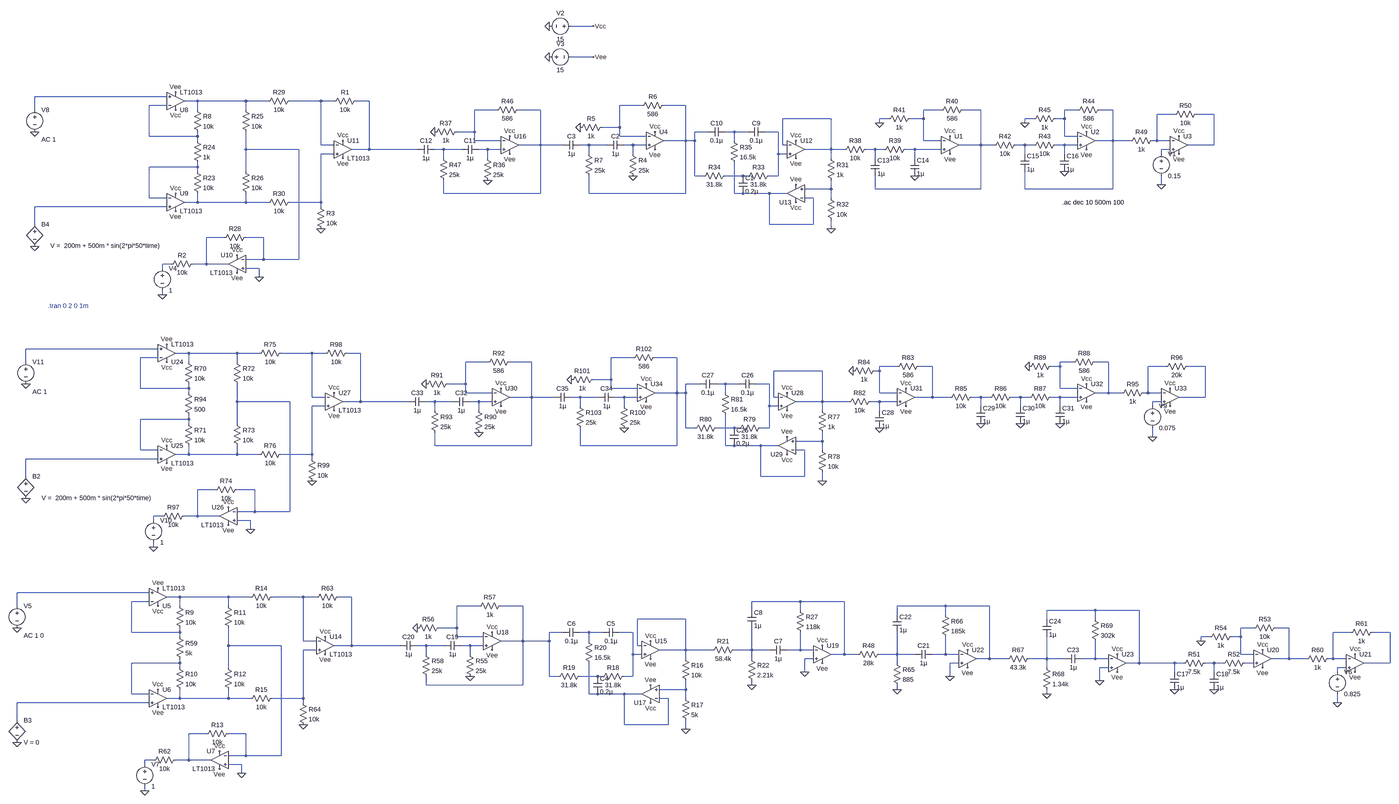
[diagram p0: schematic Final Schematic.asc, whole sheet]
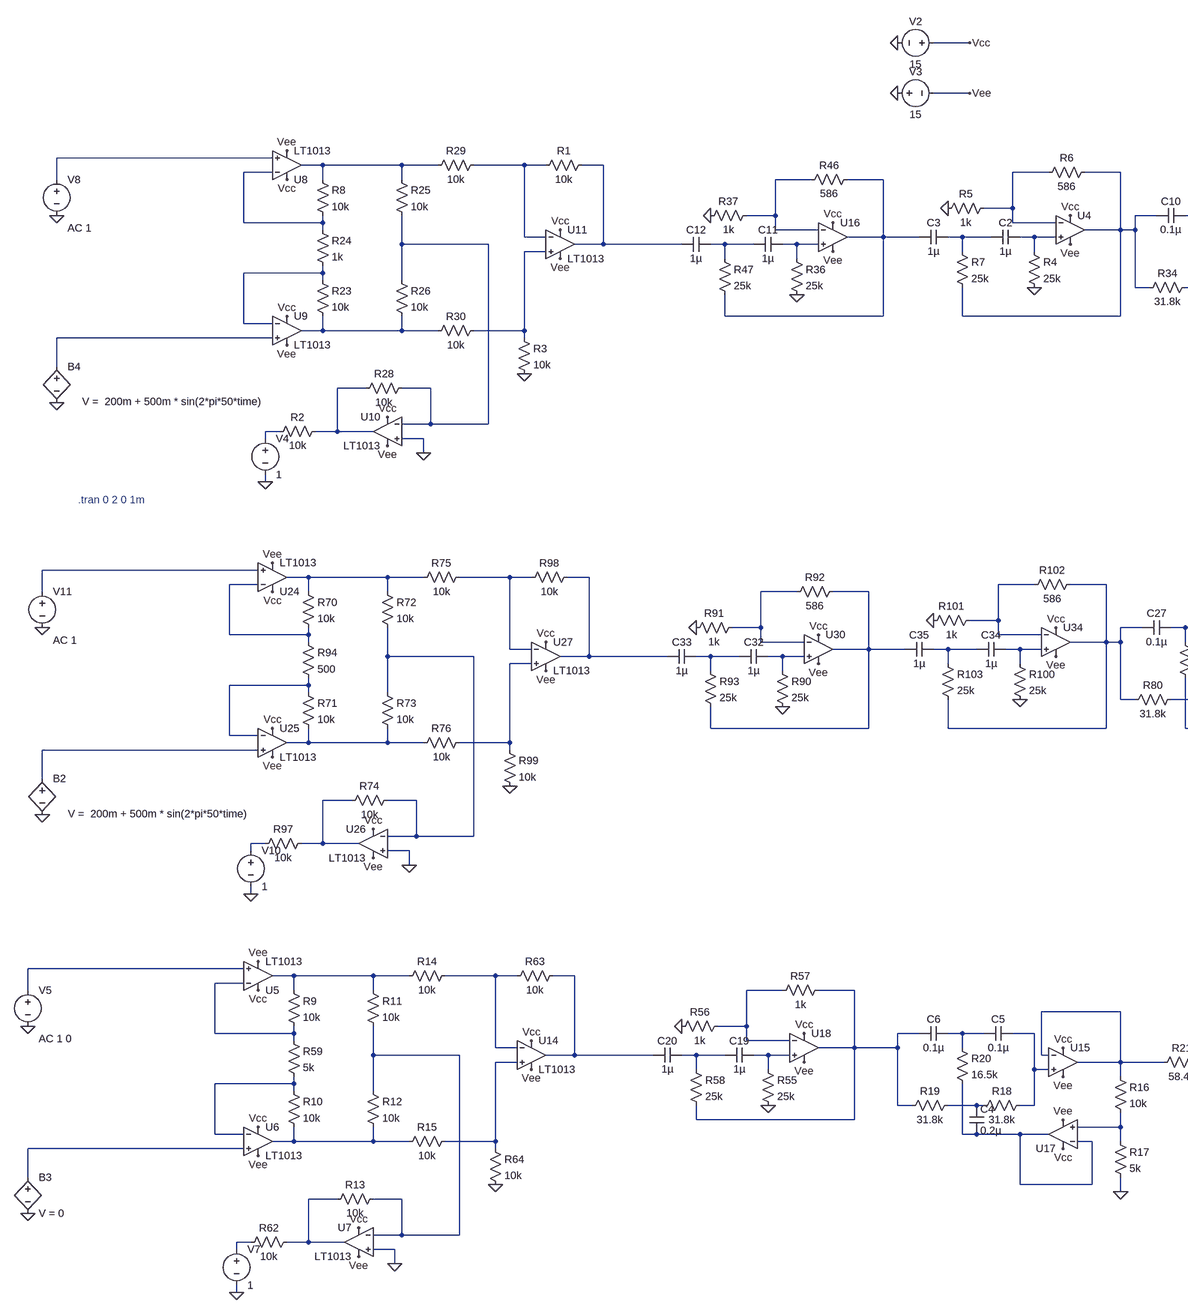
[diagram p1: schematic Final Schematic.asc, part, row 1 of 1, column 1 of 2]
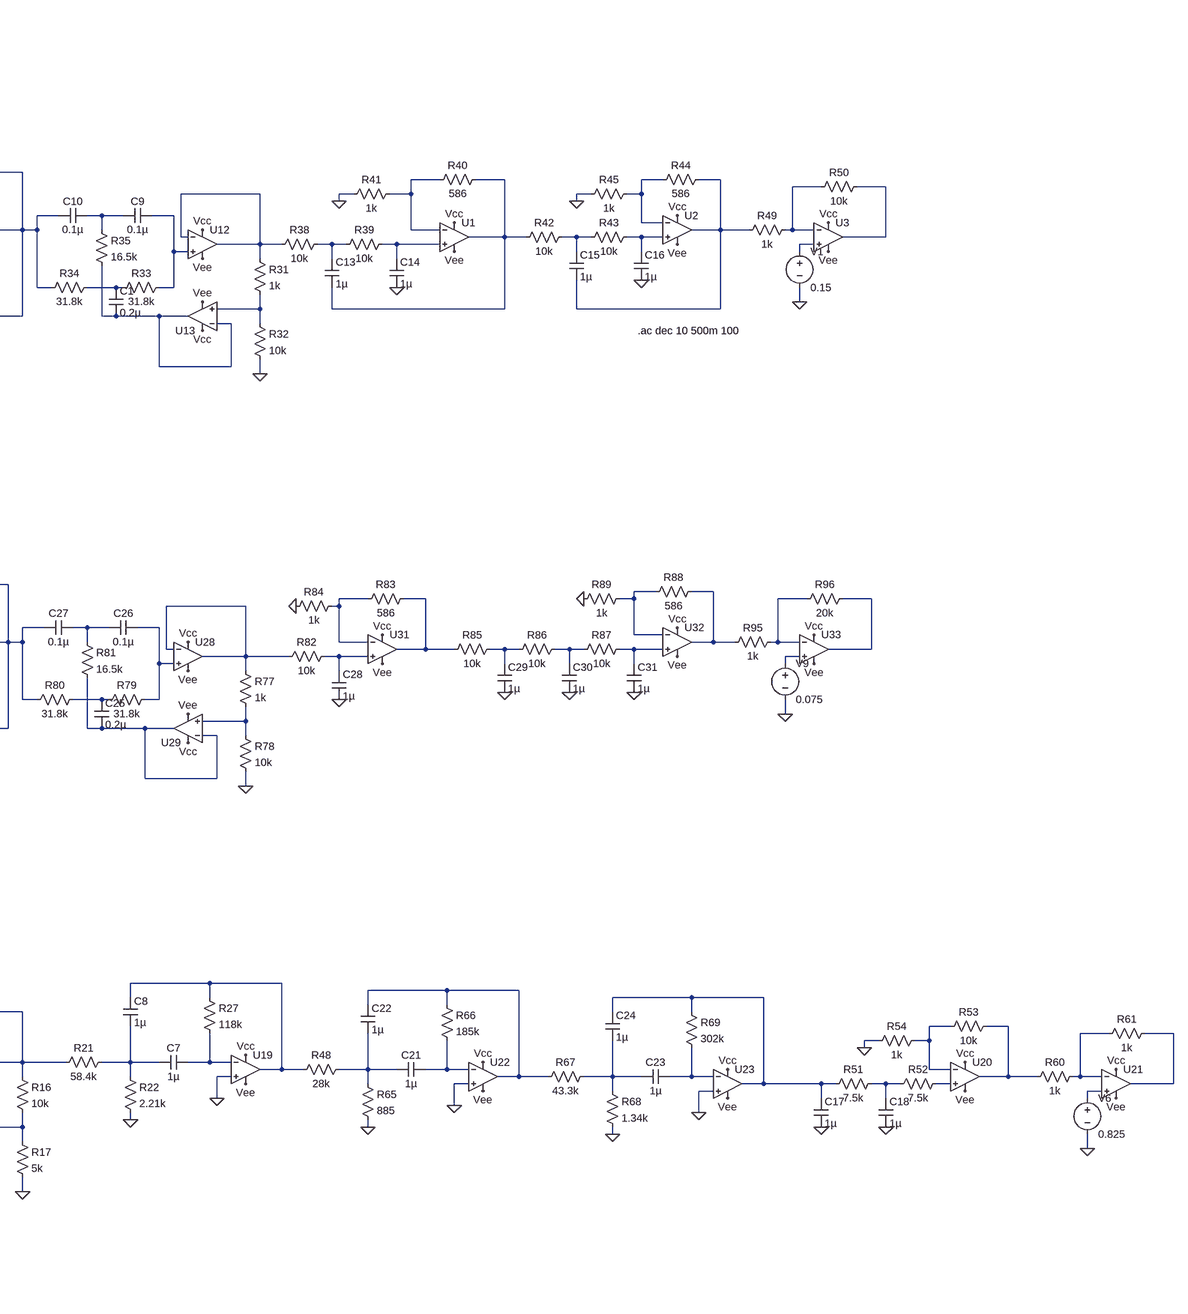
[diagram p2: schematic Final Schematic.asc, part, row 1 of 1, column 2 of 2]
Final Schematic.asc, the LTspice schematic file:
Version 4
SHEET 1 7924 5924
WIRE 2800 400 2720 400
WIRE 2800 512 2720 512
WIRE 1248 656 768 656
WIRE 1360 672 1312 672
WIRE 1536 672 1360 672
WIRE 1616 672 1536 672
WIRE 1808 672 1696 672
WIRE 1856 672 1808 672
WIRE 1984 672 1936 672
WIRE 1248 688 1184 688
WIRE 2976 688 2896 688
WIRE 3136 688 3056 688
WIRE 768 704 768 656
WIRE 1360 704 1360 672
WIRE 1536 704 1536 672
WIRE 2448 704 2368 704
WIRE 2608 704 2528 704
WIRE 4064 704 4000 704
WIRE 4208 704 4144 704
WIRE 4560 704 4512 704
WIRE 4688 704 4640 704
WIRE 4912 720 4848 720
WIRE 5056 720 4992 720
WIRE 3664 736 3488 736
WIRE 3872 736 3840 736
WIRE 4000 736 4000 704
WIRE 4000 736 3952 736
WIRE 4400 736 4368 736
WIRE 4512 736 4512 704
WIRE 4512 736 4480 736
WIRE 3840 752 3840 736
WIRE 4368 752 4368 736
WIRE 2896 768 2896 688
WIRE 2896 768 2832 768
WIRE 2368 784 2368 704
WIRE 2368 784 2304 784
WIRE 3216 784 3168 784
WIRE 3312 784 3280 784
WIRE 3360 784 3312 784
WIRE 3472 784 3424 784
WIRE 1184 800 1184 688
WIRE 1360 800 1360 784
WIRE 1360 800 1184 800
WIRE 2896 800 2896 768
WIRE 2992 800 2896 800
WIRE 4512 800 4512 736
WIRE 4560 800 4512 800
WIRE 1360 816 1360 800
WIRE 2368 816 2368 784
WIRE 2464 816 2368 816
WIRE 3136 816 3136 688
WIRE 3136 816 3056 816
WIRE 3168 816 3168 784
WIRE 3168 816 3136 816
WIRE 3312 816 3312 784
WIRE 4000 816 4000 736
WIRE 4064 816 4000 816
WIRE 4688 816 4688 704
WIRE 4688 816 4624 816
WIRE 4752 816 4688 816
WIRE 4848 816 4848 720
WIRE 4848 816 4832 816
WIRE 4896 816 4848 816
WIRE 1808 832 1808 672
WIRE 1856 832 1808 832
WIRE 2608 832 2608 704
WIRE 2608 832 2528 832
WIRE 2688 832 2608 832
WIRE 2784 832 2752 832
WIRE 2848 832 2784 832
WIRE 2944 832 2912 832
WIRE 2992 832 2944 832
WIRE 3488 832 3488 736
WIRE 3504 832 3488 832
WIRE 4208 832 4208 704
WIRE 4208 832 4128 832
WIRE 4256 832 4208 832
WIRE 4368 832 4336 832
WIRE 4400 832 4368 832
WIRE 4512 832 4480 832
WIRE 4560 832 4512 832
WIRE 5056 832 5056 720
WIRE 5056 832 4960 832
WIRE 1536 848 1536 784
WIRE 1728 848 1536 848
WIRE 1984 848 1984 672
WIRE 1984 848 1920 848
WIRE 2160 848 1984 848
WIRE 2256 848 2224 848
WIRE 2320 848 2256 848
WIRE 2416 848 2384 848
WIRE 2464 848 2416 848
WIRE 3664 848 3664 736
WIRE 3664 848 3568 848
WIRE 3712 848 3664 848
WIRE 3824 848 3792 848
WIRE 3856 848 3824 848
WIRE 3968 848 3936 848
WIRE 4064 848 3968 848
WIRE 4896 848 4864 848
WIRE 1856 864 1808 864
WIRE 2784 864 2784 832
WIRE 2944 864 2944 832
WIRE 3472 864 3472 784
WIRE 3504 864 3472 864
WIRE 4368 864 4368 832
WIRE 4512 864 4512 832
WIRE 4864 864 4864 848
WIRE 2256 880 2256 848
WIRE 2416 880 2416 848
WIRE 3664 880 3664 848
WIRE 3824 880 3824 848
WIRE 3968 880 3968 848
WIRE 1360 912 1360 896
WIRE 1360 912 1184 912
WIRE 1360 928 1360 912
WIRE 1536 928 1536 848
WIRE 3168 944 3168 816
WIRE 3200 944 3168 944
WIRE 3344 944 3280 944
WIRE 3360 944 3344 944
WIRE 3472 944 3472 864
WIRE 3472 944 3440 944
WIRE 4864 976 4864 944
WIRE 3664 992 3664 960
WIRE 3664 992 3568 992
WIRE 3824 992 3824 944
WIRE 4208 992 4208 832
WIRE 4208 992 3824 992
WIRE 4368 992 4368 928
WIRE 4688 992 4688 816
WIRE 4688 992 4368 992
WIRE 2256 1008 2256 960
WIRE 2608 1008 2608 832
WIRE 2608 1008 2256 1008
WIRE 2784 1008 2784 944
WIRE 3136 1008 3136 816
WIRE 3136 1008 2784 1008
WIRE 3312 1008 3312 896
WIRE 3344 1008 3312 1008
WIRE 3440 1008 3344 1008
WIRE 3504 1008 3440 1008
WIRE 1184 1024 1184 912
WIRE 1248 1024 1184 1024
WIRE 3600 1024 3568 1024
WIRE 3664 1024 3664 992
WIRE 1360 1040 1360 1008
WIRE 1360 1040 1312 1040
WIRE 1536 1040 1536 1008
WIRE 1536 1040 1360 1040
WIRE 1616 1040 1536 1040
WIRE 1808 1040 1808 864
WIRE 1808 1040 1696 1040
WIRE 1248 1056 768 1056
WIRE 1808 1056 1808 1040
WIRE 768 1120 768 1056
WIRE 3440 1120 3440 1008
WIRE 3600 1120 3600 1024
WIRE 3600 1120 3440 1120
WIRE 3664 1136 3664 1104
WIRE 1456 1168 1392 1168
WIRE 1600 1168 1536 1168
WIRE 1600 1248 1600 1168
WIRE 1600 1248 1536 1248
WIRE 1728 1248 1728 848
WIRE 1728 1248 1600 1248
WIRE 1264 1264 1232 1264
WIRE 1392 1264 1392 1168
WIRE 1392 1264 1344 1264
WIRE 1472 1264 1392 1264
WIRE 1232 1280 1232 1264
WIRE 1584 1280 1536 1280
WIRE 1584 1312 1584 1280
WIRE 1232 1376 1232 1360
WIRE 1216 1664 736 1664
WIRE 1328 1680 1280 1680
WIRE 1504 1680 1328 1680
WIRE 1584 1680 1504 1680
WIRE 1776 1680 1664 1680
WIRE 1824 1680 1776 1680
WIRE 1952 1680 1904 1680
WIRE 1216 1696 1152 1696
WIRE 2944 1696 2864 1696
WIRE 3104 1696 3024 1696
WIRE 736 1712 736 1664
WIRE 1328 1712 1328 1680
WIRE 1504 1712 1504 1680
WIRE 2416 1712 2336 1712
WIRE 2576 1712 2496 1712
WIRE 4544 1712 4496 1712
WIRE 4672 1712 4624 1712
WIRE 3904 1728 3840 1728
WIRE 4032 1728 3984 1728
WIRE 4496 1728 4496 1712
WIRE 4496 1728 4464 1728
WIRE 4880 1728 4816 1728
WIRE 5024 1728 4960 1728
WIRE 3632 1744 3456 1744
WIRE 3840 1744 3840 1728
WIRE 3840 1744 3824 1744
WIRE 2864 1776 2864 1696
WIRE 2864 1776 2800 1776
WIRE 2336 1792 2336 1712
WIRE 2336 1792 2272 1792
WIRE 3184 1792 3136 1792
WIRE 3280 1792 3248 1792
WIRE 3328 1792 3280 1792
WIRE 3440 1792 3392 1792
WIRE 1152 1808 1152 1696
WIRE 1328 1808 1328 1792
WIRE 1328 1808 1152 1808
WIRE 2864 1808 2864 1776
WIRE 2960 1808 2864 1808
WIRE 4496 1808 4496 1728
WIRE 4560 1808 4496 1808
WIRE 1328 1824 1328 1808
WIRE 2336 1824 2336 1792
WIRE 2432 1824 2336 1824
WIRE 3104 1824 3104 1696
WIRE 3104 1824 3024 1824
WIRE 3136 1824 3136 1792
WIRE 3136 1824 3104 1824
WIRE 3280 1824 3280 1792
WIRE 3840 1824 3840 1744
WIRE 3904 1824 3840 1824
WIRE 4672 1824 4672 1712
WIRE 4672 1824 4624 1824
WIRE 4720 1824 4672 1824
WIRE 4816 1824 4816 1728
WIRE 4816 1824 4800 1824
WIRE 4864 1824 4816 1824
WIRE 1776 1840 1776 1680
WIRE 1824 1840 1776 1840
WIRE 2576 1840 2576 1712
WIRE 2576 1840 2496 1840
WIRE 2656 1840 2576 1840
WIRE 2752 1840 2720 1840
WIRE 2816 1840 2752 1840
WIRE 2912 1840 2880 1840
WIRE 2960 1840 2912 1840
WIRE 3456 1840 3456 1744
WIRE 3472 1840 3456 1840
WIRE 4032 1840 4032 1728
WIRE 4032 1840 3968 1840
WIRE 4096 1840 4032 1840
WIRE 4208 1840 4176 1840
WIRE 4240 1840 4208 1840
WIRE 4352 1840 4320 1840
WIRE 4384 1840 4352 1840
WIRE 4496 1840 4464 1840
WIRE 4560 1840 4496 1840
WIRE 5024 1840 5024 1728
WIRE 5024 1840 4928 1840
WIRE 1504 1856 1504 1792
WIRE 1696 1856 1504 1856
WIRE 1952 1856 1952 1680
WIRE 1952 1856 1888 1856
WIRE 2128 1856 1952 1856
WIRE 2224 1856 2192 1856
WIRE 2288 1856 2224 1856
WIRE 2384 1856 2352 1856
WIRE 2432 1856 2384 1856
WIRE 3632 1856 3632 1744
WIRE 3632 1856 3536 1856
WIRE 3728 1856 3632 1856
WIRE 3840 1856 3808 1856
WIRE 3904 1856 3840 1856
WIRE 4864 1856 4832 1856
WIRE 1824 1872 1776 1872
WIRE 2752 1872 2752 1840
WIRE 2912 1872 2912 1840
WIRE 3440 1872 3440 1792
WIRE 3472 1872 3440 1872
WIRE 4208 1872 4208 1840
WIRE 4352 1872 4352 1840
WIRE 4496 1872 4496 1840
WIRE 4832 1872 4832 1856
WIRE 2224 1888 2224 1856
WIRE 2384 1888 2384 1856
WIRE 3632 1888 3632 1856
WIRE 3840 1888 3840 1856
WIRE 1328 1920 1328 1904
WIRE 1328 1920 1152 1920
WIRE 1328 1936 1328 1920
WIRE 1504 1936 1504 1856
WIRE 3136 1952 3136 1824
WIRE 3168 1952 3136 1952
WIRE 3312 1952 3248 1952
WIRE 3328 1952 3312 1952
WIRE 3440 1952 3440 1872
WIRE 3440 1952 3408 1952
WIRE 4832 1984 4832 1952
WIRE 3632 2000 3632 1968
WIRE 3632 2000 3536 2000
WIRE 2224 2016 2224 1968
WIRE 2576 2016 2576 1840
WIRE 2576 2016 2224 2016
WIRE 2752 2016 2752 1952
WIRE 3104 2016 3104 1824
WIRE 3104 2016 2752 2016
WIRE 3280 2016 3280 1904
WIRE 3312 2016 3280 2016
WIRE 3408 2016 3312 2016
WIRE 3472 2016 3408 2016
WIRE 1152 2032 1152 1920
WIRE 1216 2032 1152 2032
WIRE 3568 2032 3536 2032
WIRE 3632 2032 3632 2000
WIRE 1328 2048 1328 2016
WIRE 1328 2048 1280 2048
WIRE 1504 2048 1504 2016
WIRE 1504 2048 1328 2048
WIRE 1584 2048 1504 2048
WIRE 1776 2048 1776 1872
WIRE 1776 2048 1664 2048
WIRE 1216 2064 736 2064
WIRE 1776 2064 1776 2048
WIRE 736 2128 736 2064
WIRE 3408 2128 3408 2016
WIRE 3568 2128 3568 2032
WIRE 3568 2128 3408 2128
WIRE 3632 2144 3632 2112
WIRE 1424 2176 1360 2176
WIRE 1568 2176 1504 2176
WIRE 1568 2256 1568 2176
WIRE 1568 2256 1504 2256
WIRE 1696 2256 1696 1856
WIRE 1696 2256 1568 2256
WIRE 1232 2272 1200 2272
WIRE 1360 2272 1360 2176
WIRE 1360 2272 1312 2272
WIRE 1440 2272 1360 2272
WIRE 1200 2288 1200 2272
WIRE 1552 2288 1504 2288
WIRE 1552 2320 1552 2288
WIRE 1200 2384 1200 2368
WIRE 1184 2672 704 2672
WIRE 1296 2688 1248 2688
WIRE 1472 2688 1296 2688
WIRE 1552 2688 1472 2688
WIRE 1744 2688 1632 2688
WIRE 1792 2688 1744 2688
WIRE 1920 2688 1872 2688
WIRE 1184 2704 1120 2704
WIRE 3552 2704 3376 2704
WIRE 3712 2704 3552 2704
WIRE 704 2720 704 2672
WIRE 1296 2720 1296 2688
WIRE 1472 2720 1472 2688
WIRE 2384 2720 2304 2720
WIRE 2544 2720 2464 2720
WIRE 4080 2720 3904 2720
WIRE 4240 2720 4080 2720
WIRE 3376 2736 3376 2704
WIRE 3552 2736 3552 2704
WIRE 4624 2736 4448 2736
WIRE 4784 2736 4624 2736
WIRE 3904 2752 3904 2720
WIRE 4080 2752 4080 2720
WIRE 3136 2768 2960 2768
WIRE 4448 2768 4448 2736
WIRE 4624 2768 4624 2736
WIRE 2304 2800 2304 2720
WIRE 2304 2800 2240 2800
WIRE 5200 2800 5152 2800
WIRE 5328 2800 5280 2800
WIRE 1120 2816 1120 2704
WIRE 1296 2816 1296 2800
WIRE 1296 2816 1120 2816
WIRE 2688 2816 2640 2816
WIRE 2784 2816 2752 2816
WIRE 2832 2816 2784 2816
WIRE 2944 2816 2896 2816
WIRE 5552 2816 5488 2816
WIRE 5696 2816 5632 2816
WIRE 1296 2832 1296 2816
WIRE 2304 2832 2304 2800
WIRE 2400 2832 2304 2832
WIRE 5040 2832 5008 2832
WIRE 5152 2832 5152 2800
WIRE 5152 2832 5120 2832
WIRE 1744 2848 1744 2688
WIRE 1792 2848 1744 2848
WIRE 2544 2848 2544 2720
WIRE 2544 2848 2464 2848
WIRE 2640 2848 2640 2816
WIRE 2640 2848 2544 2848
WIRE 2784 2848 2784 2816
WIRE 5008 2848 5008 2832
WIRE 1472 2864 1472 2800
WIRE 1664 2864 1472 2864
WIRE 1920 2864 1920 2688
WIRE 1920 2864 1856 2864
WIRE 2096 2864 1920 2864
WIRE 2192 2864 2160 2864
WIRE 2256 2864 2192 2864
WIRE 2352 2864 2320 2864
WIRE 2400 2864 2352 2864
WIRE 2960 2864 2960 2768
WIRE 2976 2864 2960 2864
WIRE 1792 2880 1744 2880
WIRE 3136 2880 3136 2768
WIRE 3136 2880 3040 2880
WIRE 3232 2880 3136 2880
WIRE 3376 2880 3376 2800
WIRE 3376 2880 3312 2880
WIRE 3440 2880 3376 2880
WIRE 3552 2880 3552 2816
WIRE 3552 2880 3504 2880
WIRE 3600 2880 3552 2880
WIRE 2192 2896 2192 2864
WIRE 2352 2896 2352 2864
WIRE 2944 2896 2944 2816
WIRE 2976 2896 2944 2896
WIRE 3712 2896 3712 2704
WIRE 3712 2896 3664 2896
WIRE 3760 2896 3712 2896
WIRE 3904 2896 3904 2816
WIRE 3904 2896 3840 2896
WIRE 3968 2896 3904 2896
WIRE 4080 2896 4080 2832
WIRE 4080 2896 4032 2896
WIRE 4128 2896 4080 2896
WIRE 5152 2896 5152 2832
WIRE 5200 2896 5152 2896
WIRE 3136 2912 3136 2880
WIRE 3376 2912 3376 2880
WIRE 3600 2912 3568 2912
WIRE 4240 2912 4240 2720
WIRE 4240 2912 4192 2912
WIRE 4304 2912 4240 2912
WIRE 4448 2912 4448 2832
WIRE 4448 2912 4384 2912
WIRE 4512 2912 4448 2912
WIRE 4624 2912 4624 2848
WIRE 4624 2912 4576 2912
WIRE 4672 2912 4624 2912
WIRE 5328 2912 5328 2800
WIRE 5328 2912 5264 2912
WIRE 5392 2912 5328 2912
WIRE 5488 2912 5488 2816
WIRE 5488 2912 5472 2912
WIRE 5536 2912 5488 2912
WIRE 1296 2928 1296 2912
WIRE 1296 2928 1120 2928
WIRE 3904 2928 3904 2896
WIRE 4128 2928 4096 2928
WIRE 4784 2928 4784 2736
WIRE 4784 2928 4736 2928
WIRE 4912 2928 4784 2928
WIRE 4944 2928 4912 2928
WIRE 5056 2928 5024 2928
WIRE 5088 2928 5056 2928
WIRE 5200 2928 5168 2928
WIRE 5696 2928 5696 2816
WIRE 5696 2928 5600 2928
WIRE 1296 2944 1296 2928
WIRE 1472 2944 1472 2864
WIRE 4448 2944 4448 2912
WIRE 4672 2944 4640 2944
WIRE 5536 2944 5504 2944
WIRE 3568 2960 3568 2912
WIRE 4912 2960 4912 2928
WIRE 5056 2960 5056 2928
WIRE 5504 2960 5504 2944
WIRE 2640 2976 2640 2848
WIRE 2672 2976 2640 2976
WIRE 2816 2976 2752 2976
WIRE 2832 2976 2816 2976
WIRE 2944 2976 2944 2896
WIRE 2944 2976 2912 2976
WIRE 4096 2976 4096 2928
WIRE 4640 2992 4640 2944
WIRE 2192 3008 2192 2976
WIRE 2544 3008 2544 2848
WIRE 2544 3008 2192 3008
WIRE 3376 3008 3376 2992
WIRE 3136 3024 3136 2992
WIRE 3136 3024 3040 3024
WIRE 3904 3024 3904 3008
WIRE 1120 3040 1120 2928
WIRE 1184 3040 1120 3040
WIRE 2784 3040 2784 2928
WIRE 2816 3040 2784 3040
WIRE 2912 3040 2816 3040
WIRE 2976 3040 2912 3040
WIRE 4448 3040 4448 3024
WIRE 1296 3056 1296 3024
WIRE 1296 3056 1248 3056
WIRE 1472 3056 1472 3024
WIRE 1472 3056 1296 3056
WIRE 1552 3056 1472 3056
WIRE 1744 3056 1744 2880
WIRE 1744 3056 1632 3056
WIRE 3072 3056 3040 3056
WIRE 3136 3056 3136 3024
WIRE 1184 3072 704 3072
WIRE 1744 3072 1744 3056
WIRE 5504 3072 5504 3040
WIRE 704 3136 704 3072
WIRE 2912 3152 2912 3040
WIRE 3072 3152 3072 3056
WIRE 3072 3152 2912 3152
WIRE 3136 3168 3136 3136
WIRE 1392 3184 1328 3184
WIRE 1536 3184 1472 3184
WIRE 1536 3264 1536 3184
WIRE 1536 3264 1472 3264
WIRE 1664 3264 1664 2864
WIRE 1664 3264 1536 3264
WIRE 1200 3280 1168 3280
WIRE 1328 3280 1328 3184
WIRE 1328 3280 1280 3280
WIRE 1408 3280 1328 3280
WIRE 1168 3296 1168 3280
WIRE 1520 3296 1472 3296
WIRE 1520 3328 1520 3296
WIRE 1168 3392 1168 3376
FLAG 2640 512 0
FLAG 2640 400 0
FLAG 2800 400 Vcc
FLAG 2800 512 Vee
FLAG 1584 1312 0
FLAG 1280 704 Vcc
FLAG 1280 1008 Vcc
FLAG 1280 640 Vee
FLAG 1280 1072 Vee
FLAG 1888 816 Vcc
FLAG 1888 880 Vee
FLAG 1504 1296 Vee
FLAG 1504 1232 Vcc
FLAG 768 1200 0
FLAG 768 784 0
FLAG 3664 1136 0
FLAG 3536 816 Vcc
FLAG 3536 1040 Vcc
FLAG 3536 880 Vee
FLAG 3536 976 Vee
FLAG 3840 752 0
FLAG 4368 752 0
FLAG 4096 800 Vcc
FLAG 4096 864 Vee
FLAG 4592 784 Vcc
FLAG 4592 848 Vee
FLAG 2416 960 0
FLAG 2496 800 Vcc
FLAG 2496 864 Vee
FLAG 4864 976 0
FLAG 4928 800 Vcc
FLAG 4928 864 Vee
FLAG 1232 1376 0
FLAG 1808 1136 0
FLAG 2944 944 0
FLAG 3024 784 Vcc
FLAG 3024 848 Vee
FLAG 2224 784 0
FLAG 2752 768 0
FLAG 1520 3328 0
FLAG 1216 2720 Vcc
FLAG 1216 3024 Vcc
FLAG 1216 2656 Vee
FLAG 1216 3088 Vee
FLAG 1824 2832 Vcc
FLAG 1824 2896 Vee
FLAG 1440 3312 Vee
FLAG 1440 3248 Vcc
FLAG 704 3216 0
FLAG 704 2800 0
FLAG 3136 3168 0
FLAG 3008 2848 Vcc
FLAG 3008 3072 Vcc
FLAG 3008 2912 Vee
FLAG 3008 3008 Vee
FLAG 5056 3024 0
FLAG 4912 3024 0
FLAG 5008 2848 0
FLAG 5232 2880 Vcc
FLAG 5232 2944 Vee
FLAG 2352 2976 0
FLAG 2432 2816 Vcc
FLAG 2432 2880 Vee
FLAG 5504 3072 0
FLAG 5568 2896 Vcc
FLAG 5568 2960 Vee
FLAG 1168 3392 0
FLAG 1744 3152 0
FLAG 2160 2800 0
FLAG 3376 3008 0
FLAG 3568 2960 0
FLAG 3632 2864 Vcc
FLAG 3632 2928 Vee
FLAG 3904 3024 0
FLAG 4096 2976 0
FLAG 4160 2880 Vcc
FLAG 4160 2944 Vee
FLAG 4448 3040 0
FLAG 4640 2992 0
FLAG 4704 2896 Vcc
FLAG 4704 2960 Vee
FLAG 1552 2320 0
FLAG 1248 1712 Vcc
FLAG 1248 2016 Vcc
FLAG 1248 1648 Vee
FLAG 1248 2080 Vee
FLAG 1856 1824 Vcc
FLAG 1856 1888 Vee
FLAG 1472 2304 Vee
FLAG 1472 2240 Vcc
FLAG 736 2208 0
FLAG 736 1792 0
FLAG 3632 2144 0
FLAG 3504 1824 Vcc
FLAG 3504 2048 Vcc
FLAG 3504 1888 Vee
FLAG 3504 1984 Vee
FLAG 2384 1968 0
FLAG 2464 1808 Vcc
FLAG 2464 1872 Vee
FLAG 4832 1984 0
FLAG 4896 1808 Vcc
FLAG 4896 1872 Vee
FLAG 1200 2384 0
FLAG 1776 2144 0
FLAG 2912 1952 0
FLAG 2992 1792 Vcc
FLAG 2992 1856 Vee
FLAG 2192 1792 0
FLAG 2720 1776 0
FLAG 3840 1952 0
FLAG 3936 1808 Vcc
FLAG 3936 1872 Vee
FLAG 3744 1744 0
FLAG 4592 1792 Vcc
FLAG 4592 1856 Vee
FLAG 4384 1728 0
FLAG 4496 1936 0
FLAG 4352 1936 0
FLAG 4208 1936 0
FLAG 3968 944 0
FLAG 4512 928 0
SYMBOL voltage 2736 400 R90
WINDOW 0 -32 56 VBottom 2
WINDOW 3 32 56 VTop 2
SYMATTR InstName V2
SYMATTR Value 15
SYMBOL voltage 2624 512 R270
WINDOW 0 32 56 VTop 2
WINDOW 3 -32 56 VBottom 2
SYMATTR InstName V3
SYMATTR Value 15
SYMBOL bv 768 1104 R0
WINDOW 3 57 94 Left 2
SYMATTR Value V =  200m + 500m * sin(2*pi*50*time)
SYMATTR InstName B4
SYMBOL OpAmps\\LT1013 1280 736 M180
SYMATTR InstName U8
SYMBOL OpAmps\\LT1013 1280 976 R0
SYMATTR InstName U9
SYMBOL res 1344 688 R0
SYMATTR InstName R8
SYMATTR Value 10k
SYMBOL res 1344 912 R0
SYMATTR InstName R23
SYMATTR Value 10k
SYMBOL res 1520 688 R0
SYMATTR InstName R25
SYMATTR Value 10k
SYMBOL res 1520 912 R0
SYMATTR InstName R26
SYMATTR Value 10k
SYMBOL OpAmps\\LT1013 1504 1200 M0
SYMATTR InstName U10
SYMBOL OpAmps\\LT1013 1888 784 R0
SYMATTR InstName U11
SYMBOL res 1552 1152 R90
WINDOW 0 0 56 VBottom 2
WINDOW 3 32 56 VTop 2
SYMATTR InstName R28
SYMATTR Value 10k
SYMBOL res 1712 656 R90
WINDOW 0 0 56 VBottom 2
WINDOW 3 32 56 VTop 2
SYMATTR InstName R29
SYMATTR Value 10k
SYMBOL res 1712 1024 R90
WINDOW 0 0 56 VBottom 2
WINDOW 3 32 56 VTop 2
SYMATTR InstName R30
SYMATTR Value 10k
SYMBOL OpAmps\\UniversalOpAmp2 3536 848 R0
SYMATTR InstName U12
SYMBOL OpAmps\\UniversalOpAmp2 3536 1008 R180
SYMATTR InstName U13
SYMBOL res 3648 864 R0
SYMATTR InstName R31
SYMATTR Value 1k
SYMBOL res 3648 1008 R0
SYMATTR InstName R32
SYMATTR Value 10k
SYMBOL res 3456 928 R90
WINDOW 0 0 56 VBottom 2
WINDOW 3 32 56 VTop 2
SYMATTR InstName R33
SYMATTR Value 31.8k
SYMBOL cap 3328 944 R0
SYMATTR InstName C1
SYMATTR Value 0.2µ
SYMBOL res 3296 928 R90
WINDOW 0 0 56 VBottom 2
WINDOW 3 32 56 VTop 2
SYMATTR InstName R34
SYMATTR Value 31.8k
SYMBOL res 3296 800 R0
SYMATTR InstName R35
SYMATTR Value 16.5k
SYMBOL cap 3424 768 R90
WINDOW 0 0 32 VBottom 2
WINDOW 3 32 32 VTop 2
SYMATTR InstName C9
SYMATTR Value 0.1µ
SYMBOL cap 3280 768 R90
WINDOW 0 0 32 VBottom 2
WINDOW 3 32 32 VTop 2
SYMATTR InstName C10
SYMATTR Value 0.1µ
SYMBOL res 4160 688 R90
WINDOW 0 0 56 VBottom 2
WINDOW 3 32 56 VTop 2
SYMATTR InstName R40
SYMATTR Value 586
SYMBOL res 3968 720 R90
WINDOW 0 0 56 VBottom 2
WINDOW 3 32 56 VTop 2
SYMATTR InstName R41
SYMATTR Value 1k
SYMBOL res 4656 688 R90
WINDOW 0 0 56 VBottom 2
WINDOW 3 32 56 VTop 2
SYMATTR InstName R44
SYMATTR Value 586
SYMBOL res 4496 720 R90
WINDOW 0 0 56 VBottom 2
WINDOW 3 32 56 VTop 2
SYMATTR InstName R45
SYMATTR Value 1k
SYMBOL OpAmps\\UniversalOpAmp2 2496 832 R0
SYMATTR InstName U16
SYMBOL cap 2384 832 R90
WINDOW 0 0 32 VBottom 2
WINDOW 3 32 32 VTop 2
SYMATTR InstName C11
SYMATTR Value 1µ
SYMBOL res 2400 864 R0
SYMATTR InstName R36
SYMATTR Value 25k
SYMBOL res 2320 768 R90
WINDOW 0 0 56 VBottom 2
WINDOW 3 32 56 VTop 2
SYMATTR InstName R37
SYMATTR Value 1k
SYMBOL res 2544 688 R90
WINDOW 0 0 56 VBottom 2
WINDOW 3 32 56 VTop 2
SYMATTR InstName R46
SYMATTR Value 586
SYMBOL res 2240 864 R0
SYMATTR InstName R47
SYMATTR Value 25k
SYMBOL cap 2224 832 R90
WINDOW 0 0 32 VBottom 2
WINDOW 3 32 32 VTop 2
SYMATTR InstName C12
SYMATTR Value 1µ
SYMBOL res 1344 800 R0
SYMATTR InstName R24
SYMATTR Value 1k
SYMBOL res 4848 800 R90
WINDOW 0 0 56 VBottom 2
WINDOW 3 32 56 VTop 2
SYMATTR InstName R49
SYMATTR Value 1k
SYMBOL res 5008 704 R90
WINDOW 0 0 56 VBottom 2
WINDOW 3 32 56 VTop 2
SYMATTR InstName R50
SYMATTR Value 10k
SYMBOL OpAmps\\UniversalOpAmp2 4096 832 R0
SYMATTR InstName U1
SYMBOL OpAmps\\UniversalOpAmp2 4592 816 R0
SYMATTR InstName U2
SYMBOL OpAmps\\UniversalOpAmp2 4928 832 R0
SYMATTR InstName U3
SYMBOL res 1360 1248 R90
WINDOW 0 0 56 VBottom 2
WINDOW 3 32 56 VTop 2
SYMATTR InstName R2
SYMATTR Value 10k
SYMBOL voltage 4864 848 R0
SYMATTR InstName V1
SYMATTR Value 0.15
SYMBOL res 1952 656 R90
WINDOW 0 0 56 VBottom 2
WINDOW 3 32 56 VTop 2
SYMATTR InstName R1
SYMATTR Value 10k
SYMBOL voltage 1232 1264 R0
WINDOW 123 0 0 Left 0
WINDOW 39 0 0 Left 0
SYMATTR InstName V4
SYMATTR Value 1
SYMBOL res 1792 1040 R0
SYMATTR InstName R3
SYMATTR Value 10k
SYMBOL OpAmps\\UniversalOpAmp2 3024 816 R0
SYMATTR InstName U4
SYMBOL cap 2912 816 R90
WINDOW 0 0 32 VBottom 2
WINDOW 3 32 32 VTop 2
SYMATTR InstName C2
SYMATTR Value 1µ
SYMBOL res 2928 848 R0
SYMATTR InstName R4
SYMATTR Value 25k
SYMBOL res 2848 752 R90
WINDOW 0 0 56 VBottom 2
WINDOW 3 32 56 VTop 2
SYMATTR InstName R5
SYMATTR Value 1k
SYMBOL res 3072 672 R90
WINDOW 0 0 56 VBottom 2
WINDOW 3 32 56 VTop 2
SYMATTR InstName R6
SYMATTR Value 586
SYMBOL res 2768 848 R0
SYMATTR InstName R7
SYMATTR Value 25k
SYMBOL cap 2752 816 R90
WINDOW 0 0 32 VBottom 2
WINDOW 3 32 32 VTop 2
SYMATTR InstName C3
SYMATTR Value 1µ
SYMBOL OpAmps\\LT1013 1216 2752 M180
SYMATTR InstName U5
SYMBOL OpAmps\\LT1013 1216 2992 R0
SYMATTR InstName U6
SYMBOL res 1280 2704 R0
SYMATTR InstName R9
SYMATTR Value 10k
SYMBOL res 1280 2928 R0
SYMATTR InstName R10
SYMATTR Value 10k
SYMBOL res 1456 2704 R0
SYMATTR InstName R11
SYMATTR Value 10k
SYMBOL res 1456 2928 R0
SYMATTR InstName R12
SYMATTR Value 10k
SYMBOL OpAmps\\LT1013 1440 3216 M0
SYMATTR InstName U7
SYMBOL OpAmps\\LT1013 1824 2800 R0
SYMATTR InstName U14
SYMBOL res 1488 3168 R90
WINDOW 0 0 56 VBottom 2
WINDOW 3 32 56 VTop 2
SYMATTR InstName R13
SYMATTR Value 10k
SYMBOL res 1648 2672 R90
WINDOW 0 0 56 VBottom 2
WINDOW 3 32 56 VTop 2
SYMATTR InstName R14
SYMATTR Value 10k
SYMBOL res 1648 3040 R90
WINDOW 0 0 56 VBottom 2
WINDOW 3 32 56 VTop 2
SYMATTR InstName R15
SYMATTR Value 10k
SYMBOL OpAmps\\UniversalOpAmp2 3008 2880 R0
SYMATTR InstName U15
SYMBOL OpAmps\\UniversalOpAmp2 3008 3040 R180
SYMATTR InstName U17
SYMBOL res 3120 2896 R0
SYMATTR InstName R16
SYMATTR Value 10k
SYMBOL res 3120 3040 R0
SYMATTR InstName R17
SYMATTR Value 5k
SYMBOL res 2928 2960 R90
WINDOW 0 0 56 VBottom 2
WINDOW 3 32 56 VTop 2
SYMATTR InstName R18
SYMATTR Value 31.8k
SYMBOL cap 2800 2976 R0
SYMATTR InstName C4
SYMATTR Value 0.2µ
SYMBOL res 2768 2960 R90
WINDOW 0 0 56 VBottom 2
WINDOW 3 32 56 VTop 2
SYMATTR InstName R19
SYMATTR Value 31.8k
SYMBOL res 2768 2832 R0
SYMATTR InstName R20
SYMATTR Value 16.5k
SYMBOL cap 2896 2800 R90
WINDOW 0 0 32 VBottom 2
WINDOW 3 32 32 VTop 2
SYMATTR InstName C5
SYMATTR Value 0.1µ
SYMBOL cap 2752 2800 R90
WINDOW 0 0 32 VBottom 2
WINDOW 3 32 32 VTop 2
SYMATTR InstName C6
SYMATTR Value 0.1µ
SYMBOL cap 4896 2960 R0
SYMATTR InstName C17
SYMATTR Value 1µ
SYMBOL res 5040 2912 R90
WINDOW 0 0 56 VBottom 2
WINDOW 3 32 56 VTop 2
SYMATTR InstName R51
SYMATTR Value 7.5k
SYMBOL cap 5040 2960 R0
SYMATTR InstName C18
SYMATTR Value 1µ
SYMBOL res 5184 2912 R90
WINDOW 0 0 56 VBottom 2
WINDOW 3 32 56 VTop 2
SYMATTR InstName R52
SYMATTR Value 7.5k
SYMBOL res 5296 2784 R90
WINDOW 0 0 56 VBottom 2
WINDOW 3 32 56 VTop 2
SYMATTR InstName R53
SYMATTR Value 10k
SYMBOL res 5136 2816 R90
WINDOW 0 0 56 VBottom 2
WINDOW 3 32 56 VTop 2
SYMATTR InstName R54
SYMATTR Value 1k
SYMBOL OpAmps\\UniversalOpAmp2 2432 2848 R0
SYMATTR InstName U18
SYMBOL cap 2320 2848 R90
WINDOW 0 0 32 VBottom 2
WINDOW 3 32 32 VTop 2
SYMATTR InstName C19
SYMATTR Value 1µ
SYMBOL res 2336 2880 R0
SYMATTR InstName R55
SYMATTR Value 25k
SYMBOL res 2256 2784 R90
WINDOW 0 0 56 VBottom 2
WINDOW 3 32 56 VTop 2
SYMATTR InstName R56
SYMATTR Value 1k
SYMBOL res 2480 2704 R90
WINDOW 0 0 56 VBottom 2
WINDOW 3 32 56 VTop 2
SYMATTR InstName R57
SYMATTR Value 1k
SYMBOL res 2176 2880 R0
SYMATTR InstName R58
SYMATTR Value 25k
SYMBOL cap 2160 2848 R90
WINDOW 0 0 32 VBottom 2
WINDOW 3 32 32 VTop 2
SYMATTR InstName C20
SYMATTR Value 1µ
SYMBOL res 1280 2816 R0
SYMATTR InstName R59
SYMATTR Value 5k
SYMBOL res 5488 2896 R90
WINDOW 0 0 56 VBottom 2
WINDOW 3 32 56 VTop 2
SYMATTR InstName R60
SYMATTR Value 1k
SYMBOL res 5648 2800 R90
WINDOW 0 0 56 VBottom 2
WINDOW 3 32 56 VTop 2
SYMATTR InstName R61
SYMATTR Value 1k
SYMBOL OpAmps\\UniversalOpAmp2 5232 2912 R0
SYMATTR InstName U20
SYMBOL OpAmps\\UniversalOpAmp2 5568 2928 R0
SYMATTR InstName U21
SYMBOL res 1296 3264 R90
WINDOW 0 0 56 VBottom 2
WINDOW 3 32 56 VTop 2
SYMATTR InstName R62
SYMATTR Value 10k
SYMBOL voltage 5504 2944 R0
SYMATTR InstName V6
SYMATTR Value 0.825
SYMBOL res 1888 2672 R90
WINDOW 0 0 56 VBottom 2
WINDOW 3 32 56 VTop 2
SYMATTR InstName R63
SYMATTR Value 10k
SYMBOL voltage 1168 3280 R0
WINDOW 123 0 0 Left 0
WINDOW 39 0 0 Left 0
SYMATTR InstName V7
SYMATTR Value 1
SYMBOL res 1728 3056 R0
SYMATTR InstName R64
SYMATTR Value 10k
SYMBOL res 3328 2864 R90
WINDOW 0 0 56 VBottom 2
WINDOW 3 32 56 VTop 2
SYMATTR InstName R21
SYMATTR Value 58.4k
SYMBOL cap 3504 2864 R90
WINDOW 0 0 32 VBottom 2
WINDOW 3 32 32 VTop 2
SYMATTR InstName C7
SYMATTR Value 1µ
SYMBOL res 3360 2896 R0
SYMATTR InstName R22
SYMATTR Value 2.21k
SYMBOL cap 3360 2736 R0
SYMATTR InstName C8
SYMATTR Value 1µ
SYMBOL res 3536 2720 R0
SYMATTR InstName R27
SYMATTR Value 118k
SYMBOL OpAmps\\UniversalOpAmp2 3632 2896 R0
SYMATTR InstName U19
SYMBOL res 3856 2880 R90
WINDOW 0 0 56 VBottom 2
WINDOW 3 32 56 VTop 2
SYMATTR InstName R48
SYMATTR Value 28k
SYMBOL cap 4032 2880 R90
WINDOW 0 0 32 VBottom 2
WINDOW 3 32 32 VTop 2
SYMATTR InstName C21
SYMATTR Value 1µ
SYMBOL res 3888 2912 R0
SYMATTR InstName R65
SYMATTR Value 885
SYMBOL cap 3888 2752 R0
SYMATTR InstName C22
SYMATTR Value 1µ
SYMBOL res 4064 2736 R0
SYMATTR InstName R66
SYMATTR Value 185k
SYMBOL OpAmps\\UniversalOpAmp2 4160 2912 R0
SYMATTR InstName U22
SYMBOL res 4400 2896 R90
WINDOW 0 0 56 VBottom 2
WINDOW 3 32 56 VTop 2
SYMATTR InstName R67
SYMATTR Value 43.3k
SYMBOL cap 4576 2896 R90
WINDOW 0 0 32 VBottom 2
WINDOW 3 32 32 VTop 2
SYMATTR InstName C23
SYMATTR Value 1µ
SYMBOL res 4432 2928 R0
SYMATTR InstName R68
SYMATTR Value 1.34k
SYMBOL cap 4432 2768 R0
SYMATTR InstName C24
SYMATTR Value 1µ
SYMBOL res 4608 2752 R0
SYMATTR InstName R69
SYMATTR Value 302k
SYMBOL OpAmps\\UniversalOpAmp2 4704 2928 R0
SYMATTR InstName U23
SYMBOL bv 704 3120 R0
SYMATTR InstName B3
SYMATTR Value V = 0
SYMBOL voltage 704 2704 R0
WINDOW 123 24 124 Left 2
WINDOW 39 0 0 Left 0
SYMATTR Value2 AC 1 0
SYMATTR InstName V5
SYMATTR Value ""
SYMBOL OpAmps\\LT1013 1248 1744 M180
SYMATTR InstName U24
SYMBOL OpAmps\\LT1013 1248 1984 R0
SYMATTR InstName U25
SYMBOL res 1312 1696 R0
SYMATTR InstName R70
SYMATTR Value 10k
SYMBOL res 1312 1920 R0
SYMATTR InstName R71
SYMATTR Value 10k
SYMBOL res 1488 1696 R0
SYMATTR InstName R72
SYMATTR Value 10k
SYMBOL res 1488 1920 R0
SYMATTR InstName R73
SYMATTR Value 10k
SYMBOL OpAmps\\LT1013 1472 2208 M0
SYMATTR InstName U26
SYMBOL OpAmps\\LT1013 1856 1792 R0
SYMATTR InstName U27
SYMBOL res 1520 2160 R90
WINDOW 0 0 56 VBottom 2
WINDOW 3 32 56 VTop 2
SYMATTR InstName R74
SYMATTR Value 10k
SYMBOL res 1680 1664 R90
WINDOW 0 0 56 VBottom 2
WINDOW 3 32 56 VTop 2
SYMATTR InstName R75
SYMATTR Value 10k
SYMBOL res 1680 2032 R90
WINDOW 0 0 56 VBottom 2
WINDOW 3 32 56 VTop 2
SYMATTR InstName R76
SYMATTR Value 10k
SYMBOL OpAmps\\UniversalOpAmp2 3504 1856 R0
SYMATTR InstName U28
SYMBOL OpAmps\\UniversalOpAmp2 3504 2016 R180
SYMATTR InstName U29
SYMBOL res 3616 1872 R0
SYMATTR InstName R77
SYMATTR Value 1k
SYMBOL res 3616 2016 R0
SYMATTR InstName R78
SYMATTR Value 10k
SYMBOL res 3424 1936 R90
WINDOW 0 0 56 VBottom 2
WINDOW 3 32 56 VTop 2
SYMATTR InstName R79
SYMATTR Value 31.8k
SYMBOL cap 3296 1952 R0
SYMATTR InstName C25
SYMATTR Value 0.2µ
SYMBOL res 3264 1936 R90
WINDOW 0 0 56 VBottom 2
WINDOW 3 32 56 VTop 2
SYMATTR InstName R80
SYMATTR Value 31.8k
SYMBOL res 3264 1808 R0
SYMATTR InstName R81
SYMATTR Value 16.5k
SYMBOL cap 3392 1776 R90
WINDOW 0 0 32 VBottom 2
WINDOW 3 32 32 VTop 2
SYMATTR InstName C26
SYMATTR Value 0.1µ
SYMBOL cap 3248 1776 R90
WINDOW 0 0 32 VBottom 2
WINDOW 3 32 32 VTop 2
SYMATTR InstName C27
SYMATTR Value 0.1µ
SYMBOL OpAmps\\UniversalOpAmp2 2464 1840 R0
SYMATTR InstName U30
SYMBOL cap 2352 1840 R90
WINDOW 0 0 32 VBottom 2
WINDOW 3 32 32 VTop 2
SYMATTR InstName C32
SYMATTR Value 1µ
SYMBOL res 2368 1872 R0
SYMATTR InstName R90
SYMATTR Value 25k
SYMBOL res 2288 1776 R90
WINDOW 0 0 56 VBottom 2
WINDOW 3 32 56 VTop 2
SYMATTR InstName R91
SYMATTR Value 1k
SYMBOL res 2512 1696 R90
WINDOW 0 0 56 VBottom 2
WINDOW 3 32 56 VTop 2
SYMATTR InstName R92
SYMATTR Value 586
SYMBOL res 2208 1872 R0
SYMATTR InstName R93
SYMATTR Value 25k
SYMBOL cap 2192 1840 R90
WINDOW 0 0 32 VBottom 2
WINDOW 3 32 32 VTop 2
SYMATTR InstName C33
SYMATTR Value 1µ
SYMBOL res 1312 1808 R0
SYMATTR InstName R94
SYMATTR Value 500
SYMBOL res 4816 1808 R90
WINDOW 0 0 56 VBottom 2
WINDOW 3 32 56 VTop 2
SYMATTR InstName R95
SYMATTR Value 1k
SYMBOL res 4976 1712 R90
WINDOW 0 0 56 VBottom 2
WINDOW 3 32 56 VTop 2
SYMATTR InstName R96
SYMATTR Value 20k
SYMBOL OpAmps\\UniversalOpAmp2 4896 1840 R0
SYMATTR InstName U33
SYMBOL res 1328 2256 R90
WINDOW 0 0 56 VBottom 2
WINDOW 3 32 56 VTop 2
SYMATTR InstName R97
SYMATTR Value 10k
SYMBOL voltage 4832 1856 R0
SYMATTR InstName V9
SYMATTR Value 0.075
SYMBOL res 1920 1664 R90
WINDOW 0 0 56 VBottom 2
WINDOW 3 32 56 VTop 2
SYMATTR InstName R98
SYMATTR Value 10k
SYMBOL voltage 1200 2272 R0
WINDOW 123 0 0 Left 0
WINDOW 39 0 0 Left 0
SYMATTR InstName V10
SYMATTR Value 1
SYMBOL res 1760 2048 R0
SYMATTR InstName R99
SYMATTR Value 10k
SYMBOL OpAmps\\UniversalOpAmp2 2992 1824 R0
SYMATTR InstName U34
SYMBOL cap 2880 1824 R90
WINDOW 0 0 32 VBottom 2
WINDOW 3 32 32 VTop 2
SYMATTR InstName C34
SYMATTR Value 1µ
SYMBOL res 2896 1856 R0
SYMATTR InstName R100
SYMATTR Value 25k
SYMBOL res 2816 1760 R90
WINDOW 0 0 56 VBottom 2
WINDOW 3 32 56 VTop 2
SYMATTR InstName R101
SYMATTR Value 1k
SYMBOL res 3040 1680 R90
WINDOW 0 0 56 VBottom 2
WINDOW 3 32 56 VTop 2
SYMATTR InstName R102
SYMATTR Value 586
SYMBOL res 2736 1856 R0
SYMATTR InstName R103
SYMATTR Value 25k
SYMBOL cap 2720 1824 R90
WINDOW 0 0 32 VBottom 2
WINDOW 3 32 32 VTop 2
SYMATTR InstName C35
SYMATTR Value 1µ
SYMBOL res 3824 1840 R90
WINDOW 0 0 56 VBottom 2
WINDOW 3 32 56 VTop 2
SYMATTR InstName R82
SYMATTR Value 10k
SYMBOL cap 3824 1888 R0
SYMATTR InstName C28
SYMATTR Value 1µ
SYMBOL OpAmps\\UniversalOpAmp2 3936 1840 R0
SYMATTR InstName U31
SYMBOL res 4000 1712 R90
WINDOW 0 0 56 VBottom 2
WINDOW 3 32 56 VTop 2
SYMATTR InstName R83
SYMATTR Value 586
SYMBOL res 3840 1728 R90
WINDOW 0 0 56 VBottom 2
WINDOW 3 32 56 VTop 2
SYMATTR InstName R84
SYMATTR Value 1k
SYMBOL res 4192 1824 R90
WINDOW 0 0 56 VBottom 2
WINDOW 3 32 56 VTop 2
SYMATTR InstName R85
SYMATTR Value 10k
SYMBOL cap 4192 1872 R0
SYMATTR InstName C29
SYMATTR Value 1µ
SYMBOL res 4336 1824 R90
WINDOW 0 0 56 VBottom 2
WINDOW 3 32 56 VTop 2
SYMATTR InstName R86
SYMATTR Value 10k
SYMBOL res 4480 1824 R90
WINDOW 0 0 56 VBottom 2
WINDOW 3 32 56 VTop 2
SYMATTR InstName R87
SYMATTR Value 10k
SYMBOL cap 4336 1872 R0
SYMATTR InstName C30
SYMATTR Value 1µ
SYMBOL cap 4480 1872 R0
SYMATTR InstName C31
SYMATTR Value 1µ
SYMBOL OpAmps\\UniversalOpAmp2 4592 1824 R0
SYMATTR InstName U32
SYMBOL res 4640 1696 R90
WINDOW 0 0 56 VBottom 2
WINDOW 3 32 56 VTop 2
SYMATTR InstName R88
SYMATTR Value 586
SYMBOL res 4480 1712 R90
WINDOW 0 0 56 VBottom 2
WINDOW 3 32 56 VTop 2
SYMATTR InstName R89
SYMATTR Value 1k
SYMBOL res 3808 832 R90
WINDOW 0 0 56 VBottom 2
WINDOW 3 32 56 VTop 2
SYMATTR InstName R38
SYMATTR Value 10k
SYMBOL cap 3808 880 R0
SYMATTR InstName C13
SYMATTR Value 1µ
SYMBOL res 3952 832 R90
WINDOW 0 0 56 VBottom 2
WINDOW 3 32 56 VTop 2
SYMATTR InstName R39
SYMATTR Value 10k
SYMBOL cap 3952 880 R0
SYMATTR InstName C14
SYMATTR Value 1µ
SYMBOL res 4352 816 R90
WINDOW 0 0 56 VBottom 2
WINDOW 3 32 56 VTop 2
SYMATTR InstName R42
SYMATTR Value 10k
SYMBOL res 4496 816 R90
WINDOW 0 0 56 VBottom 2
WINDOW 3 32 56 VTop 2
SYMATTR InstName R43
SYMATTR Value 10k
SYMBOL cap 4352 864 R0
SYMATTR InstName C15
SYMATTR Value 1µ
SYMBOL cap 4496 864 R0
SYMATTR InstName C16
SYMATTR Value 1µ
SYMBOL bv 736 2112 R0
WINDOW 3 57 94 Left 2
SYMATTR Value V =  200m + 500m * sin(2*pi*50*time)
SYMATTR InstName B2
SYMBOL voltage 768 688 R0
WINDOW 123 24 124 Left 2
WINDOW 39 0 0 Left 0
SYMATTR InstName V8
SYMATTR Value ""
SYMATTR Value2 AC 1
SYMBOL voltage 736 1696 R0
WINDOW 123 24 124 Left 2
WINDOW 39 0 0 Left 0
SYMATTR InstName V11
SYMATTR Value ""
SYMATTR Value2 AC 1
TEXT 816 1416 Left 2 ;.tran 0 2 0 1m
TEXT 4504 1040 Left 2 !.ac dec 10 500m 100

The netlist it stands for:
* Final Schematic.asc
V2 Vcc 0 15
V3 0 Vee 15
B4 N035 0 V =  200m + 500m * sin(2*pi*50*time)
XU8 N001 N005 Vcc Vee N002 LT1013  ; pins In+ In- V+ V- OUT
XU9 N035 N030 Vcc Vee N034 LT1013  ; pins In+ In- V+ V- OUT
R8 N002 N005 10k
R23 N030 N034 10k
R25 N002 N023 10k
R26 N023 N034 10k
XU10 0 N023 Vcc Vee N036 LT1013  ; pins In+ In- V+ V- OUT
XU11 N029 N003 Vcc Vee N004 LT1013  ; pins In+ In- V+ V- OUT
R28 N023 N036 10k
R29 N003 N002 10k
R30 N029 N034 10k
XU12 N018 N016 Vcc Vee N016 level2 Avol=1Meg GBW=10Meg Slew=10Meg Ilimit=25m Rail=0 Vos=0 En=0 Enk=0 In=0 Ink=0 Rin=500Meg  ; pins In+ In- V+ V- OUT
XU13 N032 N033 Vcc Vee N033 level2 Avol=1Meg GBW=10Meg Slew=10Meg Ilimit=25m Rail=0 Vos=0 En=0 Enk=0 In=0 Ink=0 Rin=500Meg  ; pins In+ In- V+ V- OUT
R31 N016 N032 1k
R32 N032 0 10k
R33 N018 N031 31.8k
C1 N031 N033 0.2µ
R34 N031 N007 31.8k
R35 N017 N033 16.5k
C9 N018 N017 0.1µ
C10 N017 N007 0.1µ
R40 N011 N010 586
R41 N010 0 1k
R44 N013 N012 586
R45 N012 0 1k
XU16 N025 N008 Vcc Vee N009 level2 Avol=1Meg GBW=10Meg Slew=10Meg Ilimit=25m Rail=0 Vos=0 En=0 Enk=0 In=0 Ink=0 Rin=500Meg  ; pins In+ In- V+ V- OUT
C11 N025 N024 1µ
R36 N025 0 25k
R37 N008 0 1k
R46 N009 N008 586
R47 N024 N009 25k
C12 N024 N004 1µ
R24 N005 N030 1k
R49 N014 N013 1k
R50 N015 N014 10k
XU1 N027 N010 Vcc Vee N011 level2 Avol=1Meg GBW=10Meg Slew=10Meg Ilimit=25m Rail=0 Vos=0 En=0 Enk=0 In=0 Ink=0 Rin=500Meg  ; pins In+ In- V+ V- OUT
XU2 N022 N012 Vcc Vee N013 level2 Avol=1Meg GBW=10Meg Slew=10Meg Ilimit=25m Rail=0 Vos=0 En=0 Enk=0 In=0 Ink=0 Rin=500Meg  ; pins In+ In- V+ V- OUT
XU3 N028 N014 Vcc Vee N015 level2 Avol=1Meg GBW=10Meg Slew=10Meg Ilimit=25m Rail=0 Vos=0 En=0 Enk=0 In=0 Ink=0 Rin=500Meg  ; pins In+ In- V+ V- OUT
R2 N036 N037 10k
V1 N028 0 0.15
R1 N004 N003 10k
V4 N037 0 1
R3 N029 0 10k
XU4 N020 N006 Vcc Vee N007 level2 Avol=1Meg GBW=10Meg Slew=10Meg Ilimit=25m Rail=0 Vos=0 En=0 Enk=0 In=0 Ink=0 Rin=500Meg  ; pins In+ In- V+ V- OUT
C2 N020 N019 1µ
R4 N020 0 25k
R5 N006 0 1k
R6 N007 N006 586
R7 N019 N007 25k
C3 N019 N009 1µ
XU5 N075 N079 Vcc Vee N076 LT1013  ; pins In+ In- V+ V- OUT
XU6 N110 N102 Vcc Vee N109 LT1013  ; pins In+ In- V+ V- OUT
R9 N076 N079 10k
R10 N102 N109 10k
R11 N076 N092 10k
R12 N092 N109 10k
XU7 0 N092 Vcc Vee N111 LT1013  ; pins In+ In- V+ V- OUT
XU14 N095 N077 Vcc Vee N078 LT1013  ; pins In+ In- V+ V- OUT
R13 N092 N111 10k
R14 N077 N076 10k
R15 N095 N109 10k
XU15 N089 N085 Vcc Vee N085 level2 Avol=1Meg GBW=10Meg Slew=10Meg Ilimit=25m Rail=0 Vos=0 En=0 Enk=0 In=0 Ink=0 Rin=500Meg  ; pins In+ In- V+ V- OUT
XU17 N107 N108 Vcc Vee N108 level2 Avol=1Meg GBW=10Meg Slew=10Meg Ilimit=25m Rail=0 Vos=0 En=0 Enk=0 In=0 Ink=0 Rin=500Meg  ; pins In+ In- V+ V- OUT
R16 N085 N107 10k
R17 N107 0 5k
R18 N089 N106 31.8k
C4 N106 N108 0.2µ
R19 N106 N082 31.8k
R20 N088 N108 16.5k
C5 N089 N088 0.1µ
C6 N088 N082 0.1µ
C17 N084 0 1µ
R51 N103 N084 7.5k
C18 N103 0 1µ
R52 N104 N103 7.5k
R53 N087 N086 10k
R54 N086 0 1k
XU18 N094 N081 Vcc Vee N082 level2 Avol=1Meg GBW=10Meg Slew=10Meg Ilimit=25m Rail=0 Vos=0 En=0 Enk=0 In=0 Ink=0 Rin=500Meg  ; pins In+ In- V+ V- OUT
C19 N094 N093 1µ
R55 N094 0 25k
R56 N081 0 1k
R57 N082 N081 1k
R58 N093 N082 25k
C20 N093 N078 1µ
R59 N079 N102 5k
R60 N090 N087 1k
R61 N091 N090 1k
XU20 N104 N086 Vcc Vee N087 level2 Avol=1Meg GBW=10Meg Slew=10Meg Ilimit=25m Rail=0 Vos=0 En=0 Enk=0 In=0 Ink=0 Rin=500Meg  ; pins In+ In- V+ V- OUT
XU21 N105 N090 Vcc Vee N091 level2 Avol=1Meg GBW=10Meg Slew=10Meg Ilimit=25m Rail=0 Vos=0 En=0 Enk=0 In=0 Ink=0 Rin=500Meg  ; pins In+ In- V+ V- OUT
R62 N111 N112 10k
V6 N105 0 0.825
R63 N078 N077 10k
V7 N112 0 1
R64 N095 0 10k
R21 N096 N085 58.4k
C7 N097 N096 1µ
R22 N096 0 2.21k
C8 N080 N096 1µ
R27 N080 N097 118k
XU19 0 N097 Vcc Vee N080 level2 Avol=1Meg GBW=10Meg Slew=10Meg Ilimit=25m Rail=0 Vos=0 En=0 Enk=0 In=0 Ink=0 Rin=500Meg  ; pins In+ In- V+ V- OUT
R48 N098 N080 28k
C21 N099 N098 1µ
R65 N098 0 885
C22 N083 N098 1µ
R66 N083 N099 185k
XU22 0 N099 Vcc Vee N083 level2 Avol=1Meg GBW=10Meg Slew=10Meg Ilimit=25m Rail=0 Vos=0 En=0 Enk=0 In=0 Ink=0 Rin=500Meg  ; pins In+ In- V+ V- OUT
R67 N100 N083 43.3k
C23 N101 N100 1µ
R68 N100 0 1.34k
C24 N084 N100 1µ
R69 N084 N101 302k
XU23 0 N101 Vcc Vee N084 level2 Avol=1Meg GBW=10Meg Slew=10Meg Ilimit=25m Rail=0 Vos=0 En=0 Enk=0 In=0 Ink=0 Rin=500Meg  ; pins In+ In- V+ V- OUT
B3 N110 0 V = 0
V5 N075 0 AC 1 0
XU24 N038 N042 Vcc Vee N039 LT1013  ; pins In+ In- V+ V- OUT
XU25 N072 N067 Vcc Vee N071 LT1013  ; pins In+ In- V+ V- OUT
R70 N039 N042 10k
R71 N067 N071 10k
R72 N039 N061 10k
R73 N061 N071 10k
XU26 0 N061 Vcc Vee N073 LT1013  ; pins In+ In- V+ V- OUT
XU27 N066 N040 Vcc Vee N041 LT1013  ; pins In+ In- V+ V- OUT
R74 N061 N073 10k
R75 N040 N039 10k
R76 N066 N071 10k
XU28 N055 N053 Vcc Vee N053 level2 Avol=1Meg GBW=10Meg Slew=10Meg Ilimit=25m Rail=0 Vos=0 En=0 Enk=0 In=0 Ink=0 Rin=500Meg  ; pins In+ In- V+ V- OUT
XU29 N069 N070 Vcc Vee N070 level2 Avol=1Meg GBW=10Meg Slew=10Meg Ilimit=25m Rail=0 Vos=0 En=0 Enk=0 In=0 Ink=0 Rin=500Meg  ; pins In+ In- V+ V- OUT
R77 N053 N069 1k
R78 N069 0 10k
R79 N055 N068 31.8k
C25 N068 N070 0.2µ
R80 N068 N044 31.8k
R81 N054 N070 16.5k
C26 N055 N054 0.1µ
C27 N054 N044 0.1µ
XU30 N063 N045 Vcc Vee N046 level2 Avol=1Meg GBW=10Meg Slew=10Meg Ilimit=25m Rail=0 Vos=0 En=0 Enk=0 In=0 Ink=0 Rin=500Meg  ; pins In+ In- V+ V- OUT
C32 N063 N062 1µ
R90 N063 0 25k
R91 N045 0 1k
R92 N046 N045 586
R93 N062 N046 25k
C33 N062 N041 1µ
R94 N042 N067 500
R95 N051 N048 1k
R96 N052 N051 20k
XU33 N065 N051 Vcc Vee N052 level2 Avol=1Meg GBW=10Meg Slew=10Meg Ilimit=25m Rail=0 Vos=0 En=0 Enk=0 In=0 Ink=0 Rin=500Meg  ; pins In+ In- V+ V- OUT
R97 N073 N074 10k
V9 N065 0 0.075
R98 N041 N040 10k
V10 N074 0 1
R99 N066 0 10k
XU34 N057 N043 Vcc Vee N044 level2 Avol=1Meg GBW=10Meg Slew=10Meg Ilimit=25m Rail=0 Vos=0 En=0 Enk=0 In=0 Ink=0 Rin=500Meg  ; pins In+ In- V+ V- OUT
C34 N057 N056 1µ
R100 N057 0 25k
R101 N043 0 1k
R102 N044 N043 586
R103 N056 N044 25k
C35 N056 N046 1µ
R82 N064 N053 10k
C28 N064 0 1µ
XU31 N064 N049 Vcc Vee N050 level2 Avol=1Meg GBW=10Meg Slew=10Meg Ilimit=25m Rail=0 Vos=0 En=0 Enk=0 In=0 Ink=0 Rin=500Meg  ; pins In+ In- V+ V- OUT
R83 N050 N049 586
R84 N049 0 1k
R85 N058 N050 10k
C29 N058 0 1µ
R86 N059 N058 10k
R87 N060 N059 10k
C30 N059 0 1µ
C31 N060 0 1µ
XU32 N060 N047 Vcc Vee N048 level2 Avol=1Meg GBW=10Meg Slew=10Meg Ilimit=25m Rail=0 Vos=0 En=0 Enk=0 In=0 Ink=0 Rin=500Meg  ; pins In+ In- V+ V- OUT
R88 N048 N047 586
R89 N047 0 1k
R38 N026 N016 10k
C13 N026 N011 1µ
R39 N027 N026 10k
C14 N027 0 1µ
R42 N021 N011 10k
R43 N022 N021 10k
C15 N021 N013 1µ
C16 N022 0 1µ
B2 N072 0 V =  200m + 500m * sin(2*pi*50*time)
V8 N001 0 AC 1
V11 N038 0 AC 1
* .tran 0 2 0 1m
.ac dec 10 500m 100
.lib LTC.lib
.lib UniversalOpAmp2.lib
.backanno
.end